# EAGLE schematic ComsoftFixV4_Finished_Draft_Labeled_Complete (EAGLE 7.1.0)
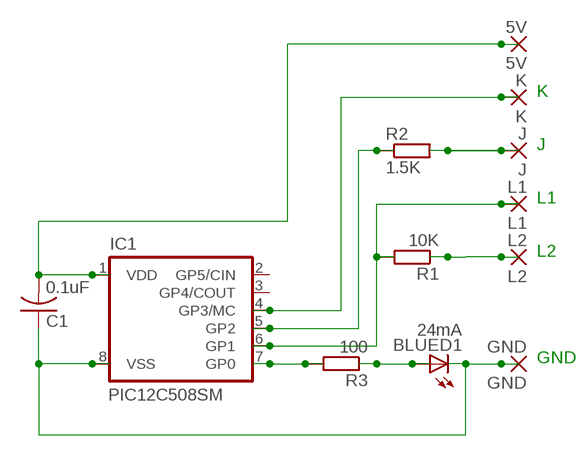
[diagram p0: schematic, sheet 1]

## Parts
5V  5V  WIREPADSMD1,27-254  [SMD1,27-2,54]
BLUED1  24mA  LEDCHIPLED_0603  [CHIPLED_0603]
C1  0.1uF  C-USC0603  [C0603]
GND  GND  WIREPADSMD1,27-254  [SMD1,27-2,54]
IC1  PIC12C508SM  [SO-08M]
J  J  WIREPADSMD1,27-254  [SMD1,27-2,54]
K  K  WIREPADSMD1,27-254  [SMD1,27-2,54]
L1  L1  WIREPADSMD1,27-254  [SMD1,27-2,54]
L2  L2  WIREPADSMD1,27-254  [SMD1,27-2,54]
R1  10K  R-EU_R0603  [R0603]
R2  1.5K  R-EU_R0603  [R0603]
R3  100  R-EU_R0603  [R0603]

## Nets
GND: BLUED1.C C1.1 GND.1(P) IC1.8(VSS)
K: J.1(P) R2.2
N$1: BLUED1.A R3.1
N$2: IC1.6(GP1) L1.1(P) R1.2
N$3: 5V.1(P) C1.2 IC1.1(VDD)
N$4: L2.1(P) R1.1
N$5: IC1.5(GP2) R2.1
N$7: IC1.4(GP3/MC) K.1(P)
N$9: IC1.7(GP0) R3.2
Unconnected: IC1.2(GP5/CIN) IC1.3(GP4/COUT)

## Notes on the sheet
- K
- J
- L1
- L2
- GND

## Library data of the parts
5V GND J K L1 L2 = wirepad:WIREPAD: Wire PAD connect wire on PCB
BLUED1 = led:LED: LED OSRAM: - CHIPLED LG R971, LG N971, LY N971, LG Q971, LY Q971, LO R971, LY R971 LH N974, LH R974 LS Q976, LO Q976, LY Q976 LO Q996 - Hyper CHIPLED LW Q18S LB Q993, LB Q99A, LB R99A - SideLED LS A670, LO A670, LY A670, LG A670, LP A670 LB A673, LV A673, LT A673, LW A673 LH A674 LY A675 LS A676, LA A676, LO A676, LY A676, LW A676 LS A679, LY A679, LG A679 - Hyper Micro SIDELED® LS Y876, LA Y876, LO Y876, LY Y876 LT Y87S - SmartLED LW L88C, LW L88S LB L89C, LB L89S, LG L890 LS L89K, LO L89K, LY L89K LS L896, LA L896, LO L896, LY L896 - TOPLED LS T670, LO T670, LY T670, LG T670, LP T670 LSG T670, LSP T670, LSY T670, LOP T670, LYG T670 LG T671, LOG T671, LSG T671 LB T673, LV T673, LT T673, LW T673 LH T674 LS T676, LA T676, LO T676, LY T676, LB T676, LH T676, LSB T676, LW T676 LB T67C, LV T67C, LT T67C, LS T67K, LO T67K, LY T67K, LW E67C LS E67B, LA E67B, LO E67B, LY E67B, LB E67C, LV E67C, LT E67C LW T67C LS T679, LY T679, LG T679 LS T770, LO T770, LY T770, LG T770, LP T770 LB T773, LV T773, LT T773, LW T773 LH T774 LS E675, LA E675, LY E675, LS T675 LS T776, LA T776, LO T776, LY T776, LB T776 LHGB T686 LT T68C, LB T68C - Hyper Mini TOPLED® LB M676 - Mini TOPLED Santana® LG M470 LS M47K, LO M47K, LY M47K Source: http://www.osram.convergy.de LUXEON: - LUMILED® LXK2-PW12-R00, LXK2-PW12-S00, LXK2-PW14-U00, LXK2-PW14-V00 LXK2-PM12-R00, LXK2-PM12-S00, LXK2-PM14-U00 LXK2-PE12-Q00, LXK2-PE12-R00, LXK2-PE12-S00, LXK2-PE14-T00, LXK2-PE14-U00 LXK2-PB12-K00, LXK2-PB12-L00, LXK2-PB12-M00, LXK2-PB14-N00, LXK2-PB14-P00, LXK2-PB14-Q00 LXK2-PR12-L00, LXK2-PR12-M00, LXK2-PR14-Q00, LXK2-PR14-R00 LXK2-PD12-Q00, LXK2-PD12-R00, LXK2-PD12-S00 LXK2-PH12-R00, LXK2-PH12-S00 LXK2-PL12-P00, LXK2-PL12-Q00, LXK2-PL12-R00 Source: www.luxeon.com KINGBRIGHT: KA-3528ASYC Source: www.kingbright.com
C1 = rcl:C-US: CAPACITOR, American symbol
IC1 = microchip:PIC12C*?: MICROCONTROLLER
R1-R3 = rcl:R-EU_: RESISTOR, European symbol